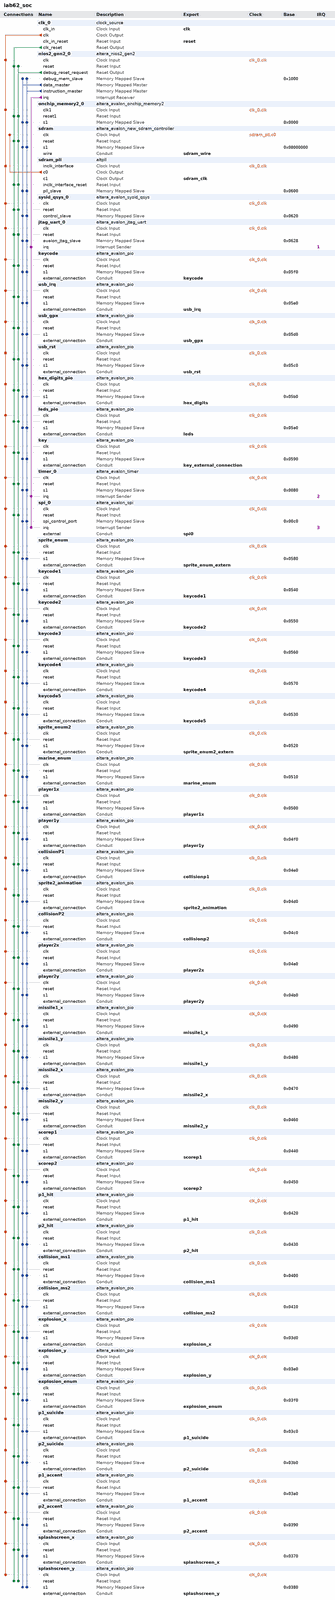
[diagram p0: system contents, whole]
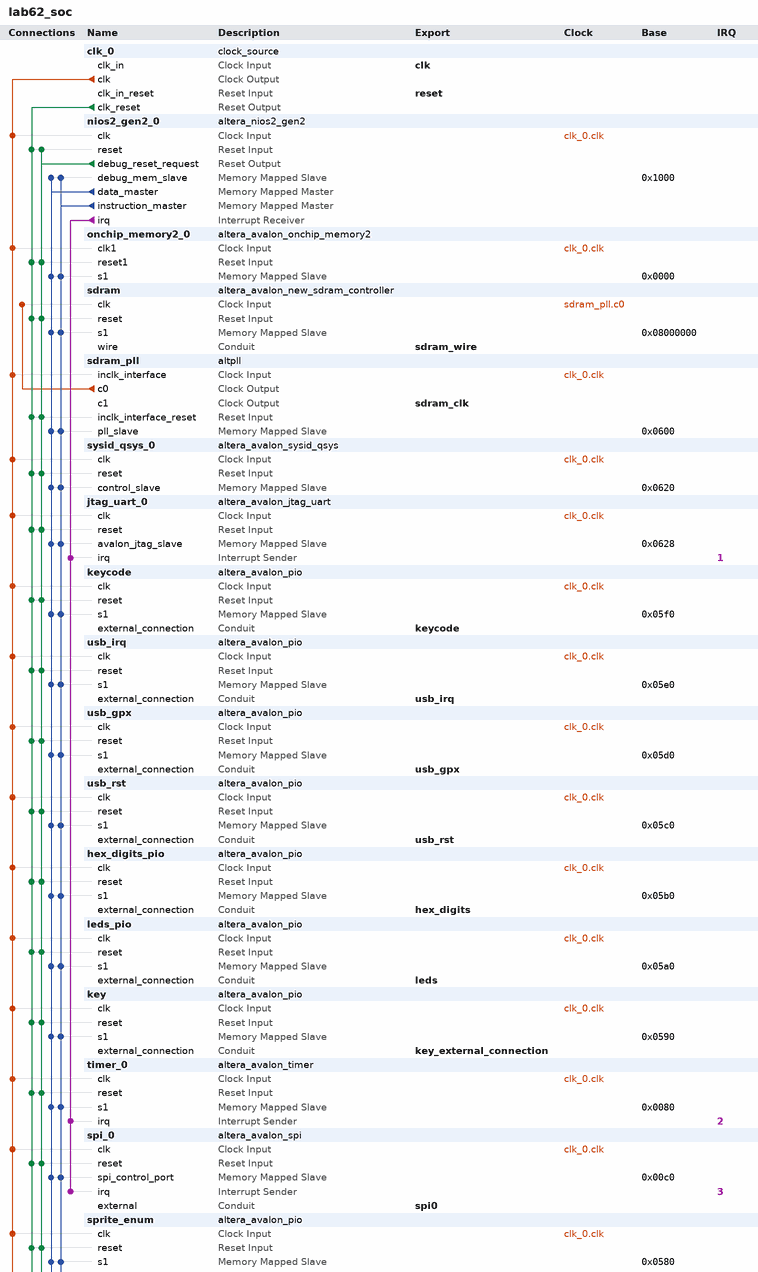
[diagram p1: system contents, upper part]
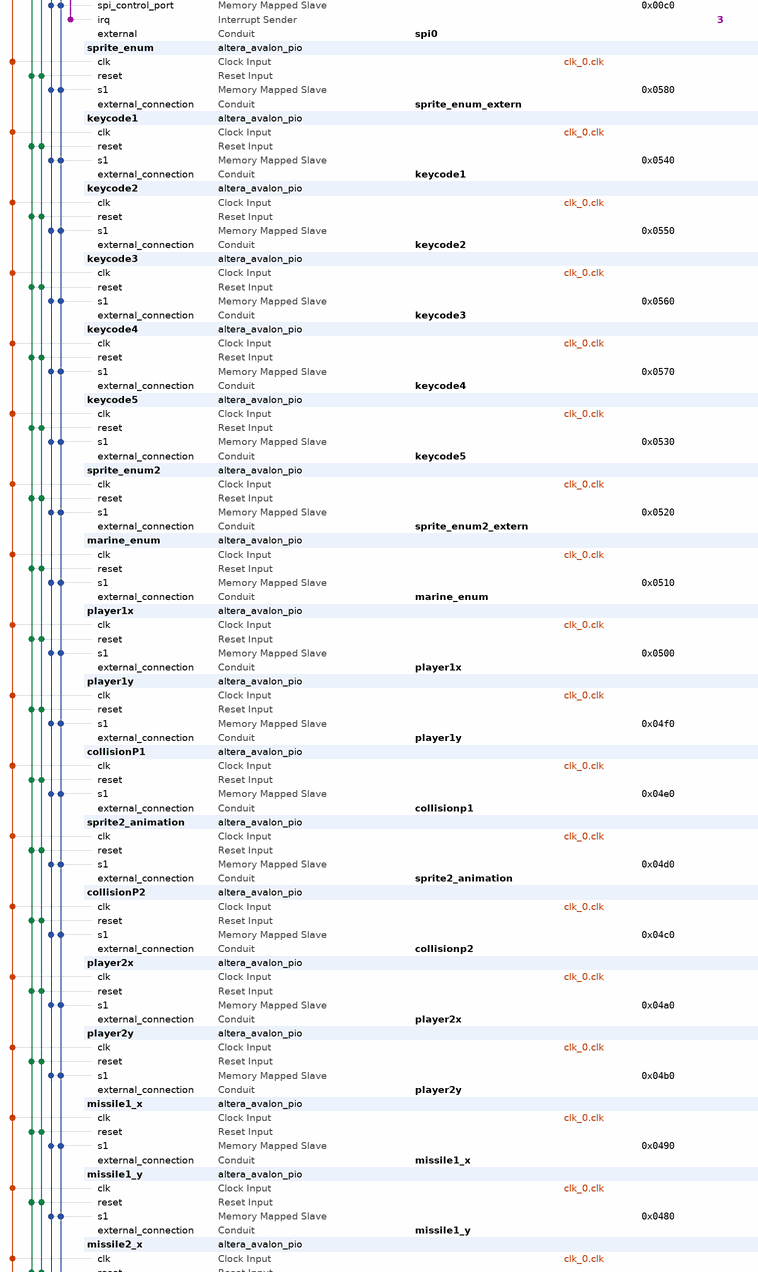
[diagram p2: system contents, middle part]
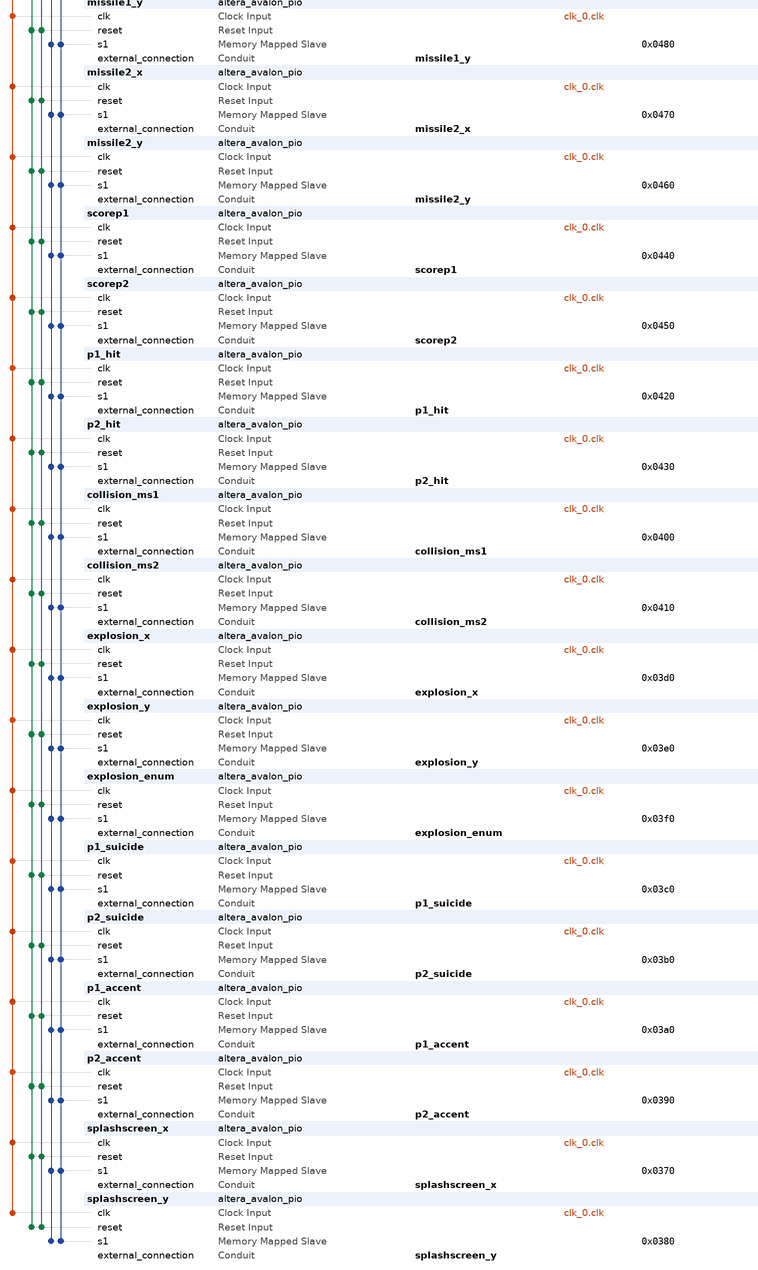
[diagram p3: system contents, lower part]
# Platform Designer (Qsys) system lab62_soc, MAX 10 10M50DAF484C7G
# Parameters at their usual value, and those the tool derives, are not listed.
package require -exact qsys 18.1
create_system lab62_soc
set_project_property DEVICE_FAMILY {MAX 10}
set_project_property DEVICE 10M50DAF484C7G

add_instance clk_0 clock_source 18.1
set_instance_parameter_value clk_0 clockFrequency 50000000

add_instance nios2_gen2_0 altera_nios2_gen2 18.1
set_instance_parameter_value nios2_gen2_0 dcache_size 2048
set_instance_parameter_value nios2_gen2_0 exceptionSlave sdram.s1
set_instance_parameter_value nios2_gen2_0 icache_size 4096
set_instance_parameter_value nios2_gen2_0 impl Tiny
set_instance_parameter_value nios2_gen2_0 resetSlave sdram.s1

add_instance onchip_memory2_0 altera_avalon_onchip_memory2 18.1
set_instance_parameter_value onchip_memory2_0 dataWidth 32
set_instance_parameter_value onchip_memory2_0 dualPort false
set_instance_parameter_value onchip_memory2_0 initMemContent true
set_instance_parameter_value onchip_memory2_0 initializationFileName onchip_mem.hex
set_instance_parameter_value onchip_memory2_0 memorySize 16

add_instance sdram altera_avalon_new_sdram_controller 18.1
set_instance_parameter_value sdram TAC 5.4
set_instance_parameter_value sdram TRCD 20.0
set_instance_parameter_value sdram TRP 20.0
set_instance_parameter_value sdram casLatency 3
set_instance_parameter_value sdram columnWidth 10
set_instance_parameter_value sdram dataWidth 16
set_instance_parameter_value sdram generateSimulationModel false
set_instance_parameter_value sdram model single_Micron_MT48LC4M32B2_7_chip
set_instance_parameter_value sdram numberOfBanks 4
set_instance_parameter_value sdram numberOfChipSelects 1
set_instance_parameter_value sdram powerUpDelay 200.0
set_instance_parameter_value sdram refreshPeriod 15.625
set_instance_parameter_value sdram rowWidth 13

add_instance sdram_pll altpll 18.1
set_instance_parameter_value sdram_pll CLK0_DIVIDE_BY 1
set_instance_parameter_value sdram_pll CLK0_MULTIPLY_BY 1
set_instance_parameter_value sdram_pll CLK1_DIVIDE_BY 1
set_instance_parameter_value sdram_pll CLK1_DUTY_CYCLE 50
set_instance_parameter_value sdram_pll CLK1_MULTIPLY_BY 1
set_instance_parameter_value sdram_pll CLK1_PHASE_SHIFT -1000
set_instance_parameter_value sdram_pll INCLK0_INPUT_FREQUENCY 20000
set_instance_parameter_value sdram_pll PORT_ARESET PORT_UNUSED
set_instance_parameter_value sdram_pll PORT_LOCKED PORT_UNUSED
set_instance_parameter_value sdram_pll PORT_clk1 PORT_USED
set_instance_parameter_value sdram_pll PORT_clk2 PORT_UNUSED
set_instance_parameter_value sdram_pll PORT_clk3 PORT_UNUSED

add_instance sysid_qsys_0 altera_avalon_sysid_qsys 18.1
set_instance_parameter_value sysid_qsys_0 id 0

add_instance jtag_uart_0 altera_avalon_jtag_uart 18.1
set_instance_parameter_value jtag_uart_0 simInteractiveOptions NO_INTERACTIVE_WINDOWS

add_instance keycode altera_avalon_pio 18.1
set_instance_parameter_value keycode direction Output
set_instance_parameter_value keycode width 8

add_instance usb_irq altera_avalon_pio 18.1
set_instance_parameter_value usb_irq direction Input
set_instance_parameter_value usb_irq width 1

add_instance usb_gpx altera_avalon_pio 18.1
set_instance_parameter_value usb_gpx direction Input
set_instance_parameter_value usb_gpx width 1

add_instance usb_rst altera_avalon_pio 18.1
set_instance_parameter_value usb_rst direction Output
set_instance_parameter_value usb_rst width 1

add_instance hex_digits_pio altera_avalon_pio 18.1
set_instance_parameter_value hex_digits_pio direction Output
set_instance_parameter_value hex_digits_pio width 16

add_instance leds_pio altera_avalon_pio 18.1
set_instance_parameter_value leds_pio direction Output
set_instance_parameter_value leds_pio width 14

add_instance key altera_avalon_pio 18.1
set_instance_parameter_value key direction Input
set_instance_parameter_value key width 2

add_instance timer_0 altera_avalon_timer 18.1
set_instance_parameter_value timer_0 counterSize 64
set_instance_parameter_value timer_0 period 1
set_instance_parameter_value timer_0 periodUnits MSEC

add_instance spi_0 altera_avalon_spi 18.1
set_instance_parameter_value spi_0 clockPolarity 0
set_instance_parameter_value spi_0 dataWidth 8
set_instance_parameter_value spi_0 masterSPI true
set_instance_parameter_value spi_0 numberOfSlaves 1
set_instance_parameter_value spi_0 targetClockRate 2500000

add_instance sprite_enum altera_avalon_pio 18.1
set_instance_parameter_value sprite_enum direction Output
set_instance_parameter_value sprite_enum width 8

add_instance keycode1 altera_avalon_pio 18.1
set_instance_parameter_value keycode1 direction Output
set_instance_parameter_value keycode1 width 8

add_instance keycode2 altera_avalon_pio 18.1
set_instance_parameter_value keycode2 direction Output
set_instance_parameter_value keycode2 width 1

add_instance keycode3 altera_avalon_pio 18.1
set_instance_parameter_value keycode3 direction Output
set_instance_parameter_value keycode3 width 1

add_instance keycode4 altera_avalon_pio 18.1
set_instance_parameter_value keycode4 direction Output
set_instance_parameter_value keycode4 width 8

add_instance keycode5 altera_avalon_pio 18.1
set_instance_parameter_value keycode5 direction Output
set_instance_parameter_value keycode5 width 8

add_instance sprite_enum2 altera_avalon_pio 18.1
set_instance_parameter_value sprite_enum2 direction Output
set_instance_parameter_value sprite_enum2 width 8

add_instance marine_enum altera_avalon_pio 18.1
set_instance_parameter_value marine_enum direction Output
set_instance_parameter_value marine_enum width 8

add_instance player1x altera_avalon_pio 18.1
set_instance_parameter_value player1x direction Output
set_instance_parameter_value player1x width 10

add_instance player1y altera_avalon_pio 18.1
set_instance_parameter_value player1y direction Output
set_instance_parameter_value player1y width 10

add_instance collisionP1 altera_avalon_pio 18.1
set_instance_parameter_value collisionP1 direction Input
set_instance_parameter_value collisionP1 width 1

add_instance sprite2_animation altera_avalon_pio 18.1
set_instance_parameter_value sprite2_animation direction Output
set_instance_parameter_value sprite2_animation width 3

add_instance collisionP2 altera_avalon_pio 18.1
set_instance_parameter_value collisionP2 direction Input
set_instance_parameter_value collisionP2 width 1

add_instance player2x altera_avalon_pio 18.1
set_instance_parameter_value player2x direction Output
set_instance_parameter_value player2x width 10

add_instance player2y altera_avalon_pio 18.1
set_instance_parameter_value player2y direction Output
set_instance_parameter_value player2y width 10

add_instance missile1_x altera_avalon_pio 18.1
set_instance_parameter_value missile1_x direction Output
set_instance_parameter_value missile1_x width 10

add_instance missile1_y altera_avalon_pio 18.1
set_instance_parameter_value missile1_y direction Output
set_instance_parameter_value missile1_y width 10

add_instance missile2_x altera_avalon_pio 18.1
set_instance_parameter_value missile2_x direction Output
set_instance_parameter_value missile2_x width 10

add_instance missile2_y altera_avalon_pio 18.1
set_instance_parameter_value missile2_y direction Output
set_instance_parameter_value missile2_y width 10

add_instance scorep1 altera_avalon_pio 18.1
set_instance_parameter_value scorep1 direction Output
set_instance_parameter_value scorep1 width 8

add_instance scorep2 altera_avalon_pio 18.1
set_instance_parameter_value scorep2 direction Output
set_instance_parameter_value scorep2 width 8

add_instance p1_hit altera_avalon_pio 18.1
set_instance_parameter_value p1_hit direction Input
set_instance_parameter_value p1_hit width 1

add_instance p2_hit altera_avalon_pio 18.1
set_instance_parameter_value p2_hit direction Input
set_instance_parameter_value p2_hit width 1

add_instance collision_ms1 altera_avalon_pio 18.1
set_instance_parameter_value collision_ms1 direction Input
set_instance_parameter_value collision_ms1 width 1

add_instance collision_ms2 altera_avalon_pio 18.1
set_instance_parameter_value collision_ms2 direction Input
set_instance_parameter_value collision_ms2 width 1

add_instance explosion_x altera_avalon_pio 18.1
set_instance_parameter_value explosion_x direction Output
set_instance_parameter_value explosion_x width 10

add_instance explosion_y altera_avalon_pio 18.1
set_instance_parameter_value explosion_y direction Output
set_instance_parameter_value explosion_y width 10

add_instance explosion_enum altera_avalon_pio 18.1
set_instance_parameter_value explosion_enum direction Output
set_instance_parameter_value explosion_enum width 8

add_instance p1_suicide altera_avalon_pio 18.1
set_instance_parameter_value p1_suicide direction Input
set_instance_parameter_value p1_suicide width 1

add_instance p2_suicide altera_avalon_pio 18.1
set_instance_parameter_value p2_suicide direction Input
set_instance_parameter_value p2_suicide width 1

add_instance p1_accent altera_avalon_pio 18.1
set_instance_parameter_value p1_accent direction Output
set_instance_parameter_value p1_accent width 24

add_instance p2_accent altera_avalon_pio 18.1
set_instance_parameter_value p2_accent direction Output
set_instance_parameter_value p2_accent width 24

add_instance splashscreen_x altera_avalon_pio 18.1
set_instance_parameter_value splashscreen_x direction Output
set_instance_parameter_value splashscreen_x width 10

add_instance splashscreen_y altera_avalon_pio 18.1
set_instance_parameter_value splashscreen_y direction Output
set_instance_parameter_value splashscreen_y width 10

# connections
add_connection clk_0.clk collision_ms1.clk clock
add_connection clk_0.clk collision_ms2.clk clock
add_connection clk_0.clk collisionP1.clk clock
add_connection clk_0.clk collisionP2.clk clock
add_connection clk_0.clk explosion_enum.clk clock
add_connection clk_0.clk explosion_x.clk clock
add_connection clk_0.clk explosion_y.clk clock
add_connection clk_0.clk hex_digits_pio.clk clock
add_connection clk_0.clk jtag_uart_0.clk clock
add_connection clk_0.clk key.clk clock
add_connection clk_0.clk keycode1.clk clock
add_connection clk_0.clk keycode2.clk clock
add_connection clk_0.clk keycode3.clk clock
add_connection clk_0.clk keycode4.clk clock
add_connection clk_0.clk keycode5.clk clock
add_connection clk_0.clk keycode.clk clock
add_connection clk_0.clk leds_pio.clk clock
add_connection clk_0.clk marine_enum.clk clock
add_connection clk_0.clk missile1_x.clk clock
add_connection clk_0.clk missile1_y.clk clock
add_connection clk_0.clk missile2_x.clk clock
add_connection clk_0.clk missile2_y.clk clock
add_connection clk_0.clk nios2_gen2_0.clk clock
add_connection clk_0.clk onchip_memory2_0.clk1 clock
add_connection clk_0.clk p1_accent.clk clock
add_connection clk_0.clk p1_hit.clk clock
add_connection clk_0.clk p1_suicide.clk clock
add_connection clk_0.clk p2_accent.clk clock
add_connection clk_0.clk p2_hit.clk clock
add_connection clk_0.clk p2_suicide.clk clock
add_connection clk_0.clk player1x.clk clock
add_connection clk_0.clk player1y.clk clock
add_connection clk_0.clk player2x.clk clock
add_connection clk_0.clk player2y.clk clock
add_connection clk_0.clk scorep1.clk clock
add_connection clk_0.clk scorep2.clk clock
add_connection clk_0.clk sdram_pll.inclk_interface clock
add_connection clk_0.clk spi_0.clk clock
add_connection clk_0.clk splashscreen_x.clk clock
add_connection clk_0.clk splashscreen_y.clk clock
add_connection clk_0.clk sprite2_animation.clk clock
add_connection clk_0.clk sprite_enum2.clk clock
add_connection clk_0.clk sprite_enum.clk clock
add_connection clk_0.clk sysid_qsys_0.clk clock
add_connection clk_0.clk timer_0.clk clock
add_connection clk_0.clk usb_gpx.clk clock
add_connection clk_0.clk usb_irq.clk clock
add_connection clk_0.clk usb_rst.clk clock
add_connection sdram_pll.c0 sdram.clk clock
add_connection clk_0.clk_reset collision_ms1.reset reset
add_connection clk_0.clk_reset collision_ms2.reset reset
add_connection clk_0.clk_reset collisionP1.reset reset
add_connection clk_0.clk_reset collisionP2.reset reset
add_connection clk_0.clk_reset explosion_enum.reset reset
add_connection clk_0.clk_reset explosion_x.reset reset
add_connection clk_0.clk_reset explosion_y.reset reset
add_connection clk_0.clk_reset hex_digits_pio.reset reset
add_connection clk_0.clk_reset jtag_uart_0.reset reset
add_connection clk_0.clk_reset key.reset reset
add_connection clk_0.clk_reset keycode1.reset reset
add_connection clk_0.clk_reset keycode2.reset reset
add_connection clk_0.clk_reset keycode3.reset reset
add_connection clk_0.clk_reset keycode4.reset reset
add_connection clk_0.clk_reset keycode5.reset reset
add_connection clk_0.clk_reset keycode.reset reset
add_connection clk_0.clk_reset leds_pio.reset reset
add_connection clk_0.clk_reset marine_enum.reset reset
add_connection clk_0.clk_reset missile1_x.reset reset
add_connection clk_0.clk_reset missile1_y.reset reset
add_connection clk_0.clk_reset missile2_x.reset reset
add_connection clk_0.clk_reset missile2_y.reset reset
add_connection clk_0.clk_reset nios2_gen2_0.reset reset
add_connection clk_0.clk_reset onchip_memory2_0.reset1 reset
add_connection clk_0.clk_reset p1_accent.reset reset
add_connection clk_0.clk_reset p1_hit.reset reset
add_connection clk_0.clk_reset p1_suicide.reset reset
add_connection clk_0.clk_reset p2_accent.reset reset
add_connection clk_0.clk_reset p2_hit.reset reset
add_connection clk_0.clk_reset p2_suicide.reset reset
add_connection clk_0.clk_reset player1x.reset reset
add_connection clk_0.clk_reset player1y.reset reset
add_connection clk_0.clk_reset player2x.reset reset
add_connection clk_0.clk_reset player2y.reset reset
add_connection clk_0.clk_reset scorep1.reset reset
add_connection clk_0.clk_reset scorep2.reset reset
add_connection clk_0.clk_reset sdram.reset reset
add_connection clk_0.clk_reset sdram_pll.inclk_interface_reset reset
add_connection clk_0.clk_reset spi_0.reset reset
add_connection clk_0.clk_reset splashscreen_x.reset reset
add_connection clk_0.clk_reset splashscreen_y.reset reset
add_connection clk_0.clk_reset sprite2_animation.reset reset
add_connection clk_0.clk_reset sprite_enum2.reset reset
add_connection clk_0.clk_reset sprite_enum.reset reset
add_connection clk_0.clk_reset sysid_qsys_0.reset reset
add_connection clk_0.clk_reset timer_0.reset reset
add_connection clk_0.clk_reset usb_gpx.reset reset
add_connection clk_0.clk_reset usb_irq.reset reset
add_connection clk_0.clk_reset usb_rst.reset reset
add_connection nios2_gen2_0.debug_reset_request collision_ms1.reset reset
add_connection nios2_gen2_0.debug_reset_request collision_ms2.reset reset
add_connection nios2_gen2_0.debug_reset_request collisionP1.reset reset
add_connection nios2_gen2_0.debug_reset_request collisionP2.reset reset
add_connection nios2_gen2_0.debug_reset_request explosion_enum.reset reset
add_connection nios2_gen2_0.debug_reset_request explosion_x.reset reset
add_connection nios2_gen2_0.debug_reset_request explosion_y.reset reset
add_connection nios2_gen2_0.debug_reset_request hex_digits_pio.reset reset
add_connection nios2_gen2_0.debug_reset_request jtag_uart_0.reset reset
add_connection nios2_gen2_0.debug_reset_request key.reset reset
add_connection nios2_gen2_0.debug_reset_request keycode1.reset reset
add_connection nios2_gen2_0.debug_reset_request keycode2.reset reset
add_connection nios2_gen2_0.debug_reset_request keycode3.reset reset
add_connection nios2_gen2_0.debug_reset_request keycode4.reset reset
add_connection nios2_gen2_0.debug_reset_request keycode5.reset reset
add_connection nios2_gen2_0.debug_reset_request keycode.reset reset
add_connection nios2_gen2_0.debug_reset_request leds_pio.reset reset
add_connection nios2_gen2_0.debug_reset_request marine_enum.reset reset
add_connection nios2_gen2_0.debug_reset_request missile1_x.reset reset
add_connection nios2_gen2_0.debug_reset_request missile1_y.reset reset
add_connection nios2_gen2_0.debug_reset_request missile2_x.reset reset
add_connection nios2_gen2_0.debug_reset_request missile2_y.reset reset
add_connection nios2_gen2_0.debug_reset_request nios2_gen2_0.reset reset
add_connection nios2_gen2_0.debug_reset_request onchip_memory2_0.reset1 reset
add_connection nios2_gen2_0.debug_reset_request p1_accent.reset reset
add_connection nios2_gen2_0.debug_reset_request p1_hit.reset reset
add_connection nios2_gen2_0.debug_reset_request p1_suicide.reset reset
add_connection nios2_gen2_0.debug_reset_request p2_accent.reset reset
add_connection nios2_gen2_0.debug_reset_request p2_hit.reset reset
add_connection nios2_gen2_0.debug_reset_request p2_suicide.reset reset
add_connection nios2_gen2_0.debug_reset_request player1x.reset reset
add_connection nios2_gen2_0.debug_reset_request player1y.reset reset
add_connection nios2_gen2_0.debug_reset_request player2x.reset reset
add_connection nios2_gen2_0.debug_reset_request player2y.reset reset
add_connection nios2_gen2_0.debug_reset_request scorep1.reset reset
add_connection nios2_gen2_0.debug_reset_request scorep2.reset reset
add_connection nios2_gen2_0.debug_reset_request sdram.reset reset
add_connection nios2_gen2_0.debug_reset_request sdram_pll.inclk_interface_reset reset
add_connection nios2_gen2_0.debug_reset_request spi_0.reset reset
add_connection nios2_gen2_0.debug_reset_request splashscreen_x.reset reset
add_connection nios2_gen2_0.debug_reset_request splashscreen_y.reset reset
add_connection nios2_gen2_0.debug_reset_request sprite2_animation.reset reset
add_connection nios2_gen2_0.debug_reset_request sprite_enum2.reset reset
add_connection nios2_gen2_0.debug_reset_request sprite_enum.reset reset
add_connection nios2_gen2_0.debug_reset_request sysid_qsys_0.reset reset
add_connection nios2_gen2_0.debug_reset_request timer_0.reset reset
add_connection nios2_gen2_0.debug_reset_request usb_gpx.reset reset
add_connection nios2_gen2_0.debug_reset_request usb_irq.reset reset
add_connection nios2_gen2_0.debug_reset_request usb_rst.reset reset
add_connection nios2_gen2_0.data_master collision_ms1.s1 avalon
set_connection_parameter_value nios2_gen2_0.data_master/collision_ms1.s1 baseAddress 0x0400
add_connection nios2_gen2_0.data_master collision_ms2.s1 avalon
set_connection_parameter_value nios2_gen2_0.data_master/collision_ms2.s1 baseAddress 0x0410
add_connection nios2_gen2_0.data_master collisionP1.s1 avalon
set_connection_parameter_value nios2_gen2_0.data_master/collisionP1.s1 baseAddress 0x04e0
add_connection nios2_gen2_0.data_master collisionP2.s1 avalon
set_connection_parameter_value nios2_gen2_0.data_master/collisionP2.s1 baseAddress 0x04c0
add_connection nios2_gen2_0.data_master explosion_enum.s1 avalon
set_connection_parameter_value nios2_gen2_0.data_master/explosion_enum.s1 baseAddress 0x03f0
add_connection nios2_gen2_0.data_master explosion_x.s1 avalon
set_connection_parameter_value nios2_gen2_0.data_master/explosion_x.s1 baseAddress 0x03d0
add_connection nios2_gen2_0.data_master explosion_y.s1 avalon
set_connection_parameter_value nios2_gen2_0.data_master/explosion_y.s1 baseAddress 0x03e0
add_connection nios2_gen2_0.data_master hex_digits_pio.s1 avalon
set_connection_parameter_value nios2_gen2_0.data_master/hex_digits_pio.s1 baseAddress 0x05b0
add_connection nios2_gen2_0.data_master jtag_uart_0.avalon_jtag_slave avalon
set_connection_parameter_value nios2_gen2_0.data_master/jtag_uart_0.avalon_jtag_slave baseAddress 0x0628
add_connection nios2_gen2_0.data_master key.s1 avalon
set_connection_parameter_value nios2_gen2_0.data_master/key.s1 baseAddress 0x0590
add_connection nios2_gen2_0.data_master keycode1.s1 avalon
set_connection_parameter_value nios2_gen2_0.data_master/keycode1.s1 baseAddress 0x0540
add_connection nios2_gen2_0.data_master keycode2.s1 avalon
set_connection_parameter_value nios2_gen2_0.data_master/keycode2.s1 baseAddress 0x0550
add_connection nios2_gen2_0.data_master keycode3.s1 avalon
set_connection_parameter_value nios2_gen2_0.data_master/keycode3.s1 baseAddress 0x0560
add_connection nios2_gen2_0.data_master keycode4.s1 avalon
set_connection_parameter_value nios2_gen2_0.data_master/keycode4.s1 baseAddress 0x0570
add_connection nios2_gen2_0.data_master keycode5.s1 avalon
set_connection_parameter_value nios2_gen2_0.data_master/keycode5.s1 baseAddress 0x0530
add_connection nios2_gen2_0.data_master keycode.s1 avalon
set_connection_parameter_value nios2_gen2_0.data_master/keycode.s1 baseAddress 0x05f0
add_connection nios2_gen2_0.data_master leds_pio.s1 avalon
set_connection_parameter_value nios2_gen2_0.data_master/leds_pio.s1 baseAddress 0x05a0
add_connection nios2_gen2_0.data_master marine_enum.s1 avalon
set_connection_parameter_value nios2_gen2_0.data_master/marine_enum.s1 baseAddress 0x0510
add_connection nios2_gen2_0.data_master missile1_x.s1 avalon
set_connection_parameter_value nios2_gen2_0.data_master/missile1_x.s1 baseAddress 0x0490
add_connection nios2_gen2_0.data_master missile1_y.s1 avalon
set_connection_parameter_value nios2_gen2_0.data_master/missile1_y.s1 baseAddress 0x0480
add_connection nios2_gen2_0.data_master missile2_x.s1 avalon
set_connection_parameter_value nios2_gen2_0.data_master/missile2_x.s1 baseAddress 0x0470
add_connection nios2_gen2_0.data_master missile2_y.s1 avalon
set_connection_parameter_value nios2_gen2_0.data_master/missile2_y.s1 baseAddress 0x0460
add_connection nios2_gen2_0.data_master nios2_gen2_0.debug_mem_slave avalon
set_connection_parameter_value nios2_gen2_0.data_master/nios2_gen2_0.debug_mem_slave baseAddress 0x1000
add_connection nios2_gen2_0.data_master onchip_memory2_0.s1 avalon
set_connection_parameter_value nios2_gen2_0.data_master/onchip_memory2_0.s1 baseAddress 0x0000
add_connection nios2_gen2_0.data_master p1_accent.s1 avalon
set_connection_parameter_value nios2_gen2_0.data_master/p1_accent.s1 baseAddress 0x03a0
add_connection nios2_gen2_0.data_master p1_hit.s1 avalon
set_connection_parameter_value nios2_gen2_0.data_master/p1_hit.s1 baseAddress 0x0420
add_connection nios2_gen2_0.data_master p1_suicide.s1 avalon
set_connection_parameter_value nios2_gen2_0.data_master/p1_suicide.s1 baseAddress 0x03c0
add_connection nios2_gen2_0.data_master p2_accent.s1 avalon
set_connection_parameter_value nios2_gen2_0.data_master/p2_accent.s1 baseAddress 0x0390
add_connection nios2_gen2_0.data_master p2_hit.s1 avalon
set_connection_parameter_value nios2_gen2_0.data_master/p2_hit.s1 baseAddress 0x0430
add_connection nios2_gen2_0.data_master p2_suicide.s1 avalon
set_connection_parameter_value nios2_gen2_0.data_master/p2_suicide.s1 baseAddress 0x03b0
add_connection nios2_gen2_0.data_master player1x.s1 avalon
set_connection_parameter_value nios2_gen2_0.data_master/player1x.s1 baseAddress 0x0500
add_connection nios2_gen2_0.data_master player1y.s1 avalon
set_connection_parameter_value nios2_gen2_0.data_master/player1y.s1 baseAddress 0x04f0
add_connection nios2_gen2_0.data_master player2x.s1 avalon
set_connection_parameter_value nios2_gen2_0.data_master/player2x.s1 baseAddress 0x04a0
add_connection nios2_gen2_0.data_master player2y.s1 avalon
set_connection_parameter_value nios2_gen2_0.data_master/player2y.s1 baseAddress 0x04b0
add_connection nios2_gen2_0.data_master scorep1.s1 avalon
set_connection_parameter_value nios2_gen2_0.data_master/scorep1.s1 baseAddress 0x0440
add_connection nios2_gen2_0.data_master scorep2.s1 avalon
set_connection_parameter_value nios2_gen2_0.data_master/scorep2.s1 baseAddress 0x0450
add_connection nios2_gen2_0.data_master sdram.s1 avalon
set_connection_parameter_value nios2_gen2_0.data_master/sdram.s1 baseAddress 0x08000000
add_connection nios2_gen2_0.data_master sdram_pll.pll_slave avalon
set_connection_parameter_value nios2_gen2_0.data_master/sdram_pll.pll_slave baseAddress 0x0600
add_connection nios2_gen2_0.data_master spi_0.spi_control_port avalon
set_connection_parameter_value nios2_gen2_0.data_master/spi_0.spi_control_port baseAddress 0x00c0
add_connection nios2_gen2_0.data_master splashscreen_x.s1 avalon
set_connection_parameter_value nios2_gen2_0.data_master/splashscreen_x.s1 baseAddress 0x0370
add_connection nios2_gen2_0.data_master splashscreen_y.s1 avalon
set_connection_parameter_value nios2_gen2_0.data_master/splashscreen_y.s1 baseAddress 0x0380
add_connection nios2_gen2_0.data_master sprite2_animation.s1 avalon
set_connection_parameter_value nios2_gen2_0.data_master/sprite2_animation.s1 baseAddress 0x04d0
add_connection nios2_gen2_0.data_master sprite_enum2.s1 avalon
set_connection_parameter_value nios2_gen2_0.data_master/sprite_enum2.s1 baseAddress 0x0520
add_connection nios2_gen2_0.data_master sprite_enum.s1 avalon
set_connection_parameter_value nios2_gen2_0.data_master/sprite_enum.s1 baseAddress 0x0580
add_connection nios2_gen2_0.data_master sysid_qsys_0.control_slave avalon
set_connection_parameter_value nios2_gen2_0.data_master/sysid_qsys_0.control_slave baseAddress 0x0620
add_connection nios2_gen2_0.data_master timer_0.s1 avalon
set_connection_parameter_value nios2_gen2_0.data_master/timer_0.s1 baseAddress 0x0080
add_connection nios2_gen2_0.data_master usb_gpx.s1 avalon
set_connection_parameter_value nios2_gen2_0.data_master/usb_gpx.s1 baseAddress 0x05d0
add_connection nios2_gen2_0.data_master usb_irq.s1 avalon
set_connection_parameter_value nios2_gen2_0.data_master/usb_irq.s1 baseAddress 0x05e0
add_connection nios2_gen2_0.data_master usb_rst.s1 avalon
set_connection_parameter_value nios2_gen2_0.data_master/usb_rst.s1 baseAddress 0x05c0
add_connection nios2_gen2_0.instruction_master collision_ms1.s1 avalon
set_connection_parameter_value nios2_gen2_0.instruction_master/collision_ms1.s1 baseAddress 0x0400
add_connection nios2_gen2_0.instruction_master collision_ms2.s1 avalon
set_connection_parameter_value nios2_gen2_0.instruction_master/collision_ms2.s1 baseAddress 0x0410
add_connection nios2_gen2_0.instruction_master collisionP1.s1 avalon
set_connection_parameter_value nios2_gen2_0.instruction_master/collisionP1.s1 baseAddress 0x04e0
add_connection nios2_gen2_0.instruction_master collisionP2.s1 avalon
set_connection_parameter_value nios2_gen2_0.instruction_master/collisionP2.s1 baseAddress 0x04c0
add_connection nios2_gen2_0.instruction_master explosion_enum.s1 avalon
set_connection_parameter_value nios2_gen2_0.instruction_master/explosion_enum.s1 baseAddress 0x03f0
add_connection nios2_gen2_0.instruction_master explosion_x.s1 avalon
set_connection_parameter_value nios2_gen2_0.instruction_master/explosion_x.s1 baseAddress 0x03d0
add_connection nios2_gen2_0.instruction_master explosion_y.s1 avalon
set_connection_parameter_value nios2_gen2_0.instruction_master/explosion_y.s1 baseAddress 0x03e0
add_connection nios2_gen2_0.instruction_master hex_digits_pio.s1 avalon
set_connection_parameter_value nios2_gen2_0.instruction_master/hex_digits_pio.s1 baseAddress 0x05b0
add_connection nios2_gen2_0.instruction_master jtag_uart_0.avalon_jtag_slave avalon
set_connection_parameter_value nios2_gen2_0.instruction_master/jtag_uart_0.avalon_jtag_slave baseAddress 0x0628
add_connection nios2_gen2_0.instruction_master key.s1 avalon
set_connection_parameter_value nios2_gen2_0.instruction_master/key.s1 baseAddress 0x0590
add_connection nios2_gen2_0.instruction_master keycode1.s1 avalon
set_connection_parameter_value nios2_gen2_0.instruction_master/keycode1.s1 baseAddress 0x0540
add_connection nios2_gen2_0.instruction_master keycode2.s1 avalon
set_connection_parameter_value nios2_gen2_0.instruction_master/keycode2.s1 baseAddress 0x0550
add_connection nios2_gen2_0.instruction_master keycode3.s1 avalon
set_connection_parameter_value nios2_gen2_0.instruction_master/keycode3.s1 baseAddress 0x0560
add_connection nios2_gen2_0.instruction_master keycode4.s1 avalon
set_connection_parameter_value nios2_gen2_0.instruction_master/keycode4.s1 baseAddress 0x0570
add_connection nios2_gen2_0.instruction_master keycode5.s1 avalon
set_connection_parameter_value nios2_gen2_0.instruction_master/keycode5.s1 baseAddress 0x0530
add_connection nios2_gen2_0.instruction_master keycode.s1 avalon
set_connection_parameter_value nios2_gen2_0.instruction_master/keycode.s1 baseAddress 0x05f0
add_connection nios2_gen2_0.instruction_master leds_pio.s1 avalon
set_connection_parameter_value nios2_gen2_0.instruction_master/leds_pio.s1 baseAddress 0x05a0
add_connection nios2_gen2_0.instruction_master marine_enum.s1 avalon
set_connection_parameter_value nios2_gen2_0.instruction_master/marine_enum.s1 baseAddress 0x0510
add_connection nios2_gen2_0.instruction_master missile1_x.s1 avalon
set_connection_parameter_value nios2_gen2_0.instruction_master/missile1_x.s1 baseAddress 0x0490
add_connection nios2_gen2_0.instruction_master missile1_y.s1 avalon
set_connection_parameter_value nios2_gen2_0.instruction_master/missile1_y.s1 baseAddress 0x0480
add_connection nios2_gen2_0.instruction_master missile2_x.s1 avalon
set_connection_parameter_value nios2_gen2_0.instruction_master/missile2_x.s1 baseAddress 0x0470
add_connection nios2_gen2_0.instruction_master missile2_y.s1 avalon
set_connection_parameter_value nios2_gen2_0.instruction_master/missile2_y.s1 baseAddress 0x0460
add_connection nios2_gen2_0.instruction_master nios2_gen2_0.debug_mem_slave avalon
set_connection_parameter_value nios2_gen2_0.instruction_master/nios2_gen2_0.debug_mem_slave baseAddress 0x1000
add_connection nios2_gen2_0.instruction_master onchip_memory2_0.s1 avalon
set_connection_parameter_value nios2_gen2_0.instruction_master/onchip_memory2_0.s1 baseAddress 0x0000
add_connection nios2_gen2_0.instruction_master p1_accent.s1 avalon
set_connection_parameter_value nios2_gen2_0.instruction_master/p1_accent.s1 baseAddress 0x03a0
add_connection nios2_gen2_0.instruction_master p1_hit.s1 avalon
set_connection_parameter_value nios2_gen2_0.instruction_master/p1_hit.s1 baseAddress 0x0420
add_connection nios2_gen2_0.instruction_master p1_suicide.s1 avalon
set_connection_parameter_value nios2_gen2_0.instruction_master/p1_suicide.s1 baseAddress 0x03c0
add_connection nios2_gen2_0.instruction_master p2_accent.s1 avalon
set_connection_parameter_value nios2_gen2_0.instruction_master/p2_accent.s1 baseAddress 0x0390
add_connection nios2_gen2_0.instruction_master p2_hit.s1 avalon
set_connection_parameter_value nios2_gen2_0.instruction_master/p2_hit.s1 baseAddress 0x0430
add_connection nios2_gen2_0.instruction_master p2_suicide.s1 avalon
set_connection_parameter_value nios2_gen2_0.instruction_master/p2_suicide.s1 baseAddress 0x03b0
add_connection nios2_gen2_0.instruction_master player1x.s1 avalon
set_connection_parameter_value nios2_gen2_0.instruction_master/player1x.s1 baseAddress 0x0500
add_connection nios2_gen2_0.instruction_master player1y.s1 avalon
set_connection_parameter_value nios2_gen2_0.instruction_master/player1y.s1 baseAddress 0x04f0
add_connection nios2_gen2_0.instruction_master player2x.s1 avalon
set_connection_parameter_value nios2_gen2_0.instruction_master/player2x.s1 baseAddress 0x04a0
add_connection nios2_gen2_0.instruction_master player2y.s1 avalon
set_connection_parameter_value nios2_gen2_0.instruction_master/player2y.s1 baseAddress 0x04b0
add_connection nios2_gen2_0.instruction_master scorep1.s1 avalon
set_connection_parameter_value nios2_gen2_0.instruction_master/scorep1.s1 baseAddress 0x0440
add_connection nios2_gen2_0.instruction_master scorep2.s1 avalon
set_connection_parameter_value nios2_gen2_0.instruction_master/scorep2.s1 baseAddress 0x0450
add_connection nios2_gen2_0.instruction_master sdram.s1 avalon
set_connection_parameter_value nios2_gen2_0.instruction_master/sdram.s1 baseAddress 0x08000000
add_connection nios2_gen2_0.instruction_master sdram_pll.pll_slave avalon
set_connection_parameter_value nios2_gen2_0.instruction_master/sdram_pll.pll_slave baseAddress 0x0600
add_connection nios2_gen2_0.instruction_master spi_0.spi_control_port avalon
set_connection_parameter_value nios2_gen2_0.instruction_master/spi_0.spi_control_port baseAddress 0x00c0
add_connection nios2_gen2_0.instruction_master splashscreen_x.s1 avalon
set_connection_parameter_value nios2_gen2_0.instruction_master/splashscreen_x.s1 baseAddress 0x0370
add_connection nios2_gen2_0.instruction_master splashscreen_y.s1 avalon
set_connection_parameter_value nios2_gen2_0.instruction_master/splashscreen_y.s1 baseAddress 0x0380
add_connection nios2_gen2_0.instruction_master sprite2_animation.s1 avalon
set_connection_parameter_value nios2_gen2_0.instruction_master/sprite2_animation.s1 baseAddress 0x04d0
add_connection nios2_gen2_0.instruction_master sprite_enum2.s1 avalon
set_connection_parameter_value nios2_gen2_0.instruction_master/sprite_enum2.s1 baseAddress 0x0520
add_connection nios2_gen2_0.instruction_master sprite_enum.s1 avalon
set_connection_parameter_value nios2_gen2_0.instruction_master/sprite_enum.s1 baseAddress 0x0580
add_connection nios2_gen2_0.instruction_master sysid_qsys_0.control_slave avalon
set_connection_parameter_value nios2_gen2_0.instruction_master/sysid_qsys_0.control_slave baseAddress 0x0620
add_connection nios2_gen2_0.instruction_master timer_0.s1 avalon
set_connection_parameter_value nios2_gen2_0.instruction_master/timer_0.s1 baseAddress 0x0080
add_connection nios2_gen2_0.instruction_master usb_gpx.s1 avalon
set_connection_parameter_value nios2_gen2_0.instruction_master/usb_gpx.s1 baseAddress 0x05d0
add_connection nios2_gen2_0.instruction_master usb_irq.s1 avalon
set_connection_parameter_value nios2_gen2_0.instruction_master/usb_irq.s1 baseAddress 0x05e0
add_connection nios2_gen2_0.instruction_master usb_rst.s1 avalon
set_connection_parameter_value nios2_gen2_0.instruction_master/usb_rst.s1 baseAddress 0x05c0
add_connection nios2_gen2_0.irq jtag_uart_0.irq interrupt
set_connection_parameter_value nios2_gen2_0.irq/jtag_uart_0.irq irqNumber 1
add_connection nios2_gen2_0.irq spi_0.irq interrupt
set_connection_parameter_value nios2_gen2_0.irq/spi_0.irq irqNumber 3
add_connection nios2_gen2_0.irq timer_0.irq interrupt
set_connection_parameter_value nios2_gen2_0.irq/timer_0.irq irqNumber 2

# exported interfaces
add_interface clk clock sink
set_interface_property clk EXPORT_OF clk_0.clk_in
add_interface collision_ms1 conduit end
set_interface_property collision_ms1 EXPORT_OF collision_ms1.external_connection
add_interface collision_ms2 conduit end
set_interface_property collision_ms2 EXPORT_OF collision_ms2.external_connection
add_interface collisionp1 conduit end
set_interface_property collisionp1 EXPORT_OF collisionP1.external_connection
add_interface collisionp2 conduit end
set_interface_property collisionp2 EXPORT_OF collisionP2.external_connection
add_interface explosion_enum conduit end
set_interface_property explosion_enum EXPORT_OF explosion_enum.external_connection
add_interface explosion_x conduit end
set_interface_property explosion_x EXPORT_OF explosion_x.external_connection
add_interface explosion_y conduit end
set_interface_property explosion_y EXPORT_OF explosion_y.external_connection
add_interface hex_digits conduit end
set_interface_property hex_digits EXPORT_OF hex_digits_pio.external_connection
add_interface key_external_connection conduit end
set_interface_property key_external_connection EXPORT_OF key.external_connection
add_interface keycode conduit end
set_interface_property keycode EXPORT_OF keycode.external_connection
add_interface keycode1 conduit end
set_interface_property keycode1 EXPORT_OF keycode1.external_connection
add_interface keycode2 conduit end
set_interface_property keycode2 EXPORT_OF keycode2.external_connection
add_interface keycode3 conduit end
set_interface_property keycode3 EXPORT_OF keycode3.external_connection
add_interface keycode4 conduit end
set_interface_property keycode4 EXPORT_OF keycode4.external_connection
add_interface keycode5 conduit end
set_interface_property keycode5 EXPORT_OF keycode5.external_connection
add_interface leds conduit end
set_interface_property leds EXPORT_OF leds_pio.external_connection
add_interface marine_enum conduit end
set_interface_property marine_enum EXPORT_OF marine_enum.external_connection
add_interface missile1_x conduit end
set_interface_property missile1_x EXPORT_OF missile1_x.external_connection
add_interface missile1_y conduit end
set_interface_property missile1_y EXPORT_OF missile1_y.external_connection
add_interface missile2_x conduit end
set_interface_property missile2_x EXPORT_OF missile2_x.external_connection
add_interface missile2_y conduit end
set_interface_property missile2_y EXPORT_OF missile2_y.external_connection
add_interface p1_accent conduit end
set_interface_property p1_accent EXPORT_OF p1_accent.external_connection
add_interface p1_hit conduit end
set_interface_property p1_hit EXPORT_OF p1_hit.external_connection
add_interface p1_suicide conduit end
set_interface_property p1_suicide EXPORT_OF p1_suicide.external_connection
add_interface p2_accent conduit end
set_interface_property p2_accent EXPORT_OF p2_accent.external_connection
add_interface p2_hit conduit end
set_interface_property p2_hit EXPORT_OF p2_hit.external_connection
add_interface p2_suicide conduit end
set_interface_property p2_suicide EXPORT_OF p2_suicide.external_connection
add_interface player1x conduit end
set_interface_property player1x EXPORT_OF player1x.external_connection
add_interface player1y conduit end
set_interface_property player1y EXPORT_OF player1y.external_connection
add_interface player2x conduit end
set_interface_property player2x EXPORT_OF player2x.external_connection
add_interface player2y conduit end
set_interface_property player2y EXPORT_OF player2y.external_connection
add_interface reset reset sink
set_interface_property reset EXPORT_OF clk_0.clk_in_reset
add_interface scorep1 conduit end
set_interface_property scorep1 EXPORT_OF scorep1.external_connection
add_interface scorep2 conduit end
set_interface_property scorep2 EXPORT_OF scorep2.external_connection
add_interface sdram_clk clock source
set_interface_property sdram_clk EXPORT_OF sdram_pll.c1
add_interface sdram_wire conduit end
set_interface_property sdram_wire EXPORT_OF sdram.wire
add_interface spi0 conduit end
set_interface_property spi0 EXPORT_OF spi_0.external
add_interface splashscreen_x conduit end
set_interface_property splashscreen_x EXPORT_OF splashscreen_x.external_connection
add_interface splashscreen_y conduit end
set_interface_property splashscreen_y EXPORT_OF splashscreen_y.external_connection
add_interface sprite2_animation conduit end
set_interface_property sprite2_animation EXPORT_OF sprite2_animation.external_connection
add_interface sprite_enum2_extern conduit end
set_interface_property sprite_enum2_extern EXPORT_OF sprite_enum2.external_connection
add_interface sprite_enum_extern conduit end
set_interface_property sprite_enum_extern EXPORT_OF sprite_enum.external_connection
add_interface usb_gpx conduit end
set_interface_property usb_gpx EXPORT_OF usb_gpx.external_connection
add_interface usb_irq conduit end
set_interface_property usb_irq EXPORT_OF usb_irq.external_connection
add_interface usb_rst conduit end
set_interface_property usb_rst EXPORT_OF usb_rst.external_connection

set_interconnect_requirement {$system} qsys_mm.clockCrossingAdapter HANDSHAKE
set_interconnect_requirement {$system} qsys_mm.enableEccProtection FALSE
set_interconnect_requirement {$system} qsys_mm.insertDefaultSlave FALSE
set_interconnect_requirement {$system} qsys_mm.maxAdditionalLatency 1

save_system lab62_soc.qsys
